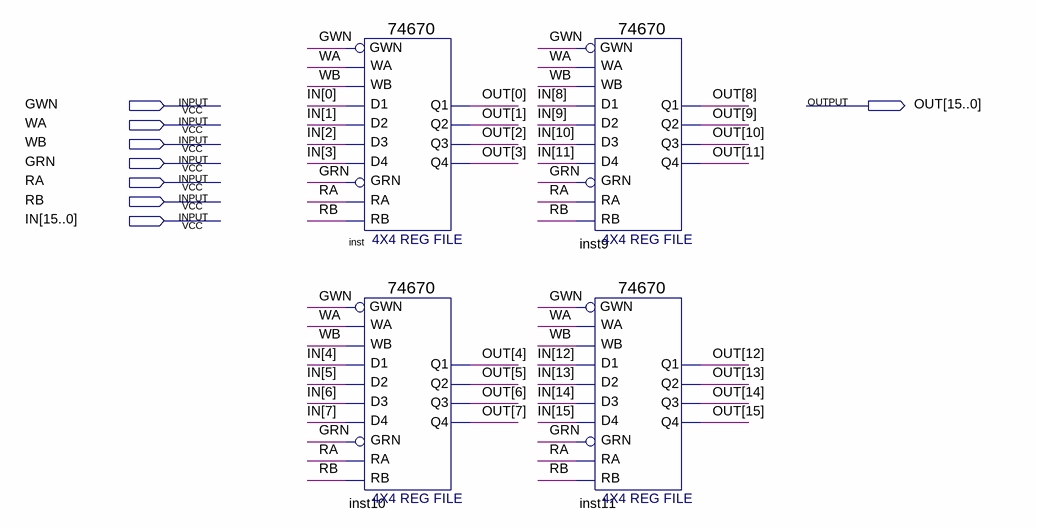
[diagram p0: schematic sheet]
// Quartus schematic RegisterGroup_16bitX4.bdf as structural Verilog: 4 symbols, 8 pins
module RegisterGroup_16bitX4 (
  input  GWN,
  input  WA,
  input  WB,
  input  GRN,
  input  RA,
  input  RB,
  input  [15:0] IN,
  output [15:0] OUT
);

  \74670  inst (
    .WA(WA), .D1(IN[0]), .WB(WB), .D2(IN[1]), .GRN(GRN), .D4(IN[3]), .D3(IN[2]), .RA(RA), .RB(RB), .GWN(GWN),
    .Q3(OUT[2]), .Q4(OUT[3]), .Q1(OUT[0]), .Q2(OUT[1]));
  \74670  inst10 (
    .WA(WA), .D1(IN[4]), .WB(WB), .D2(IN[5]), .GRN(GRN), .D4(IN[7]), .D3(IN[6]), .RA(RA), .RB(RB), .GWN(GWN),
    .Q3(OUT[6]), .Q4(OUT[7]), .Q1(OUT[4]), .Q2(OUT[5]));
  \74670  inst9 (
    .WA(WA), .D1(IN[8]), .WB(WB), .D2(IN[9]), .GRN(GRN), .D4(IN[11]), .D3(IN[10]), .RA(RA), .RB(RB),
    .GWN(GWN), .Q3(OUT[10]), .Q4(OUT[11]), .Q1(OUT[8]), .Q2(OUT[9]));
  \74670  inst11 (
    .WA(WA), .D1(IN[12]), .WB(WB), .D2(IN[13]), .GRN(GRN), .D4(IN[15]), .D3(IN[14]), .RA(RA), .RB(RB),
    .GWN(GWN), .Q3(OUT[14]), .Q4(OUT[15]), .Q1(OUT[12]), .Q2(OUT[13]));
endmodule
